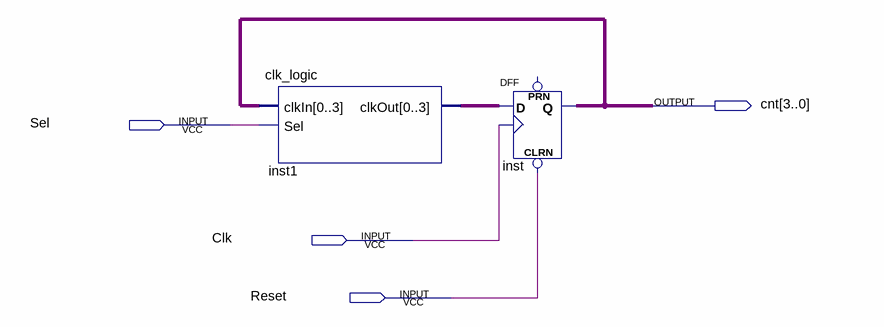
[diagram p0: schematic sheet]
// Quartus schematic cnt_4bit.bdf as structural Verilog: 2 symbols, 4 pins
module cnt_4bit (
  input  Sel,
  input  Clk,
  input  Reset,
  output [3:0] cnt
);

  wire [3:0] inst1_clkout;

  clk_logic inst1 (.clkIn(cnt), .Sel(Sel), .clkOut(inst1_clkout));
  DFF inst[3:0] (.CLRN(Reset), .CLK(Clk), .D(inst1_clkout), .Q(cnt));  // open: PRN
endmodule
